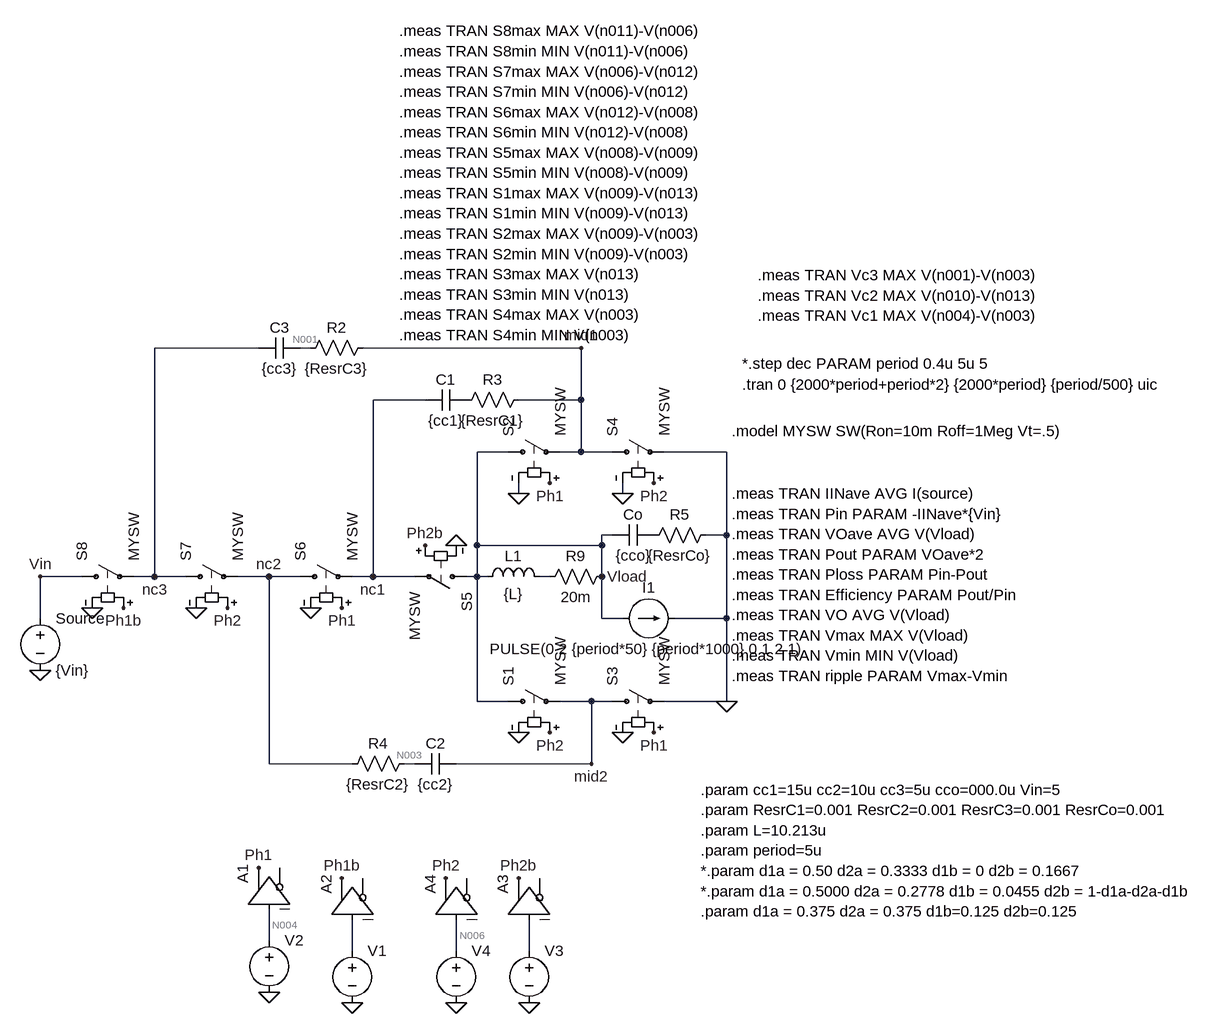
[diagram p0: schematic 4to1_dickson_split_phase_diff_cap.asc]
4to1_dickson_split_phase_diff_cap.asc, the LTspice schematic file:
Version 4
SHEET 1 1904 1156
WIRE -48 -272 -208 -272
WIRE 32 -272 16 -272
WIRE 448 -272 112 -272
WIRE 208 -192 128 -192
WIRE 448 -192 448 -272
WIRE 448 -192 352 -192
WIRE 336 -112 288 -112
WIRE 448 -112 448 -192
WIRE 448 -112 416 -112
WIRE 496 -112 448 -112
WIRE 672 -112 576 -112
WIRE 352 -48 352 -64
WIRE 512 -48 512 -64
WIRE 496 16 480 16
WIRE 672 16 672 -112
WIRE 672 16 640 16
WIRE 288 32 288 -112
WIRE 480 32 480 16
WIRE 480 32 288 32
WIRE -320 80 -384 80
WIRE -208 80 -208 -272
WIRE -208 80 -240 80
WIRE -160 80 -208 80
WIRE -32 80 -80 80
WIRE 16 80 -32 80
WIRE 128 80 128 -192
WIRE 128 80 96 80
WIRE 192 80 128 80
WIRE 288 80 288 32
WIRE 288 80 272 80
WIRE 304 80 288 80
WIRE 400 80 384 80
WIRE 480 80 480 32
WIRE -384 144 -384 80
WIRE 480 144 480 80
WIRE 512 144 480 144
WIRE 672 144 672 16
WIRE 672 144 592 144
WIRE 288 272 288 80
WIRE 336 272 288 272
WIRE 464 272 416 272
WIRE 496 272 464 272
WIRE 672 272 672 144
WIRE 672 272 576 272
WIRE -32 368 -32 80
WIRE 96 368 -32 368
WIRE 192 368 176 368
WIRE 464 368 464 272
WIRE 464 368 256 368
WIRE -32 640 -32 592
WIRE 96 656 96 608
WIRE 256 656 256 608
WIRE 368 656 368 608
FLAG -32 720 0
FLAG -48 528 Ph1
FLAG -384 224 0
FLAG -256 128 Ph1b
FLAG 80 128 Ph1
FLAG 400 -64 Ph1
FLAG 560 320 Ph1
FLAG -96 128 Ph2
FLAG 208 32 Ph2b
FLAG 560 -64 Ph2
FLAG 400 320 Ph2
FLAG -304 128 0
FLAG -144 128 0
FLAG 32 128 0
FLAG 256 32 0
FLAG 352 -48 0
FLAG 352 320 0
FLAG 512 -48 0
FLAG 512 320 0
FLAG -384 80 Vin
FLAG 480 80 Vload
FLAG 672 272 0
FLAG 240 544 Ph2
FLAG 96 736 0
FLAG 80 544 Ph1b
FLAG 368 736 0
FLAG 352 544 Ph2b
FLAG 256 736 0
FLAG 448 -272 mid1
FLAG 464 368 mid2
FLAG -208 80 nc3
FLAG -32 80 nc2
FLAG 128 80 nc1
SYMBOL voltage -32 624 R0
WINDOW 123 0 0 Left 2
WINDOW 39 0 0 Left 2
WINDOW 3 24 96 Invisible 2
SYMATTR Value PULSE(0 1 0 1p 1p {period*(d1a+d1b)-1p} {period})
SYMATTR InstName V2
SYMBOL Digital\\buf -96 592 R270
SYMATTR InstName A1
SYMBOL voltage -384 128 R0
WINDOW 123 0 0 Left 2
WINDOW 39 0 0 Left 2
SYMATTR InstName Source
SYMATTR Value {Vin}
SYMBOL sw -336 80 R270
SYMATTR InstName S8
SYMATTR Value MYSW
SYMBOL sw -176 80 R270
SYMATTR InstName S7
SYMATTR Value MYSW
SYMBOL sw 0 80 R270
SYMATTR InstName S6
SYMATTR Value MYSW
SYMBOL sw 288 80 R90
SYMATTR InstName S5
SYMATTR Value MYSW
SYMBOL sw 320 -112 R270
SYMATTR InstName S2
SYMATTR Value MYSW
SYMBOL sw 480 -112 R270
SYMATTR InstName S4
SYMATTR Value MYSW
SYMBOL sw 480 272 R270
SYMATTR InstName S3
SYMATTR Value MYSW
SYMBOL sw 320 272 R270
SYMATTR InstName S1
SYMATTR Value MYSW
SYMBOL cap -48 -256 R270
WINDOW 0 32 32 VTop 2
WINDOW 3 0 32 VBottom 2
SYMATTR InstName C3
SYMATTR Value {cc3}
SYMATTR SpiceLine ic={Vin/4*3}
SYMBOL cap 208 -176 R270
WINDOW 0 32 32 VTop 2
WINDOW 3 0 32 VBottom 2
SYMATTR InstName C1
SYMATTR Value {cc1}
SYMATTR SpiceLine ic={Vin/4*1}
SYMBOL cap 192 384 R270
WINDOW 0 32 32 VTop 2
WINDOW 3 0 32 VBottom 2
SYMATTR InstName C2
SYMATTR Value {cc2}
SYMATTR SpiceLine ic={Vin/4*2}
SYMBOL cap 496 32 R270
WINDOW 0 32 32 VTop 2
WINDOW 3 0 32 VBottom 2
SYMATTR InstName Co
SYMATTR Value {cco}
SYMBOL res 16 -256 R270
WINDOW 0 32 56 VTop 2
WINDOW 3 0 56 VBottom 2
SYMATTR InstName R2
SYMATTR Value {ResrC3}
SYMBOL res 256 -176 R270
WINDOW 0 32 56 VTop 2
WINDOW 3 0 56 VBottom 2
SYMATTR InstName R3
SYMATTR Value {ResrC1}
SYMBOL res 80 384 R270
WINDOW 0 32 56 VTop 2
WINDOW 3 0 56 VBottom 2
SYMATTR InstName R4
SYMATTR Value {ResrC2}
SYMBOL res 544 32 R270
WINDOW 0 32 56 VTop 2
WINDOW 3 0 56 VBottom 2
SYMATTR InstName R5
SYMATTR Value {ResrCo}
SYMBOL current 512 144 R270
WINDOW 0 32 40 VTop 2
WINDOW 3 -32 40 VBottom 2
WINDOW 123 0 0 Left 2
WINDOW 39 0 0 Left 2
SYMATTR InstName I1
SYMATTR Value PULSE(0 2 {period*50} {period*1000} 0 1 2 1)
SYMBOL ind 288 96 R270
WINDOW 0 32 56 VTop 2
WINDOW 3 5 56 VBottom 2
SYMATTR InstName L1
SYMATTR Value {L}
SYMATTR SpiceLine Rser=0
SYMBOL res 496 64 R90
WINDOW 0 0 56 VBottom 2
WINDOW 3 32 56 VTop 2
SYMATTR InstName R9
SYMATTR Value 20m
SYMBOL voltage 96 640 R0
WINDOW 123 0 0 Left 2
WINDOW 39 0 0 Left 2
WINDOW 3 24 96 Invisible 2
SYMATTR Value PULSE(0 1 0 1p 1p {period*d1a-1p} {period})
SYMATTR InstName V1
SYMBOL Digital\\buf 32 608 R270
SYMATTR InstName A2
SYMBOL voltage 368 640 R0
WINDOW 123 0 0 Left 2
WINDOW 39 0 0 Left 2
WINDOW 3 24 96 Invisible 2
SYMATTR Value PULSE(0 1 {period*(d1a+d1b)} 1p 1p {period*d2a-1p} {period})
SYMATTR InstName V3
SYMBOL Digital\\buf 304 608 R270
SYMATTR InstName A3
SYMBOL voltage 256 640 R0
WINDOW 123 0 0 Left 2
WINDOW 39 0 0 Left 2
WINDOW 3 24 96 Invisible 2
SYMATTR Value PULSE(0 1 {period*(d1a+d1b)} 1p 1p {period*(d2a+d2b)-1p} {period})
SYMATTR InstName V4
SYMBOL Digital\\buf 192 608 R270
SYMATTR InstName A4
TEXT 696 -216 Left 2 !.tran 0 {2000*period+period*2} {2000*period} {period/500} uic
TEXT 680 -144 Left 2 !.model MYSW SW(Ron=10m Roff=1Meg Vt=.5)
TEXT 680 -48 Left 2 !.meas TRAN IINave AVG I(source)\n.meas TRAN Pin PARAM -IINave*{Vin}\n.meas TRAN VOave AVG V(Vload)\n.meas TRAN Pout PARAM VOave*2\n.meas TRAN Ploss PARAM Pin-Pout\n.meas TRAN Efficiency PARAM Pout/Pin\n.meas TRAN VO AVG V(Vload)\n.meas TRAN Vmax MAX V(Vload)\n.meas TRAN Vmin MIN V(Vload)\n.meas TRAN ripple PARAM Vmax-Vmin
TEXT 632 408 Left 2 !.param cc1=15u cc2=10u cc3=5u cco=000.0u Vin=5\n.param ResrC1=0.001 ResrC2=0.001 ResrC3=0.001 ResrCo=0.001\n.param L=10.213u\n.param period=5u\n*.param d1a = 0.50 d2a = 0.3333 d1b = 0 d2b = 0.1667\n*.param d1a = 0.5000 d2a = 0.2778 d1b = 0.0455 d2b = 1-d1a-d2a-d1b\n.param d1a = 0.375 d2a = 0.375 d1b=0.125 d2b=0.125
TEXT 696 -248 Left 2 !*.step dec PARAM period 0.4u 5u 5
TEXT 720 -384 Left 2 !.meas TRAN Vc3 MAX V(n001)-V(n003)\n.meas TRAN Vc2 MAX V(n010)-V(n013)\n.meas TRAN Vc1 MAX V(n004)-V(n003)
TEXT 168 -760 Left 2 !.meas TRAN S8max MAX V(n011)-V(n006)\n.meas TRAN S8min MIN V(n011)-V(n006)\n.meas TRAN S7max MAX V(n006)-V(n012)\n.meas TRAN S7min MIN V(n006)-V(n012)\n.meas TRAN S6max MAX V(n012)-V(n008)\n.meas TRAN S6min MIN V(n012)-V(n008)\n.meas TRAN S5max MAX V(n008)-V(n009)\n.meas TRAN S5min MIN V(n008)-V(n009)\n.meas TRAN S1max MAX V(n009)-V(n013)\n.meas TRAN S1min MIN V(n009)-V(n013)\n.meas TRAN S2max MAX V(n009)-V(n003)\n.meas TRAN S2min MIN V(n009)-V(n003)\n.meas TRAN S3max MAX V(n013)\n.meas TRAN S3min MIN V(n013)\n.meas TRAN S4max MAX V(n003)\n.meas TRAN S4min MIN V(n003)

The netlist it stands for:
* 4to1_dickson_split_phase_diff_cap.asc
V2 N004 0 PULSE(0 1 0 1p 1p {period*(d1a+d1b)-1p} {period})
A1 N004 0 0 0 0 0 Ph1 0 BUF
V§Source Vin 0 {Vin}
S8 Vin nc3 Ph1b 0 MYSW
S7 nc3 nc2 Ph2 0 MYSW
S6 nc2 nc1 Ph1 0 MYSW
S5 Vload nc1 Ph2b 0 MYSW
S2 Vload mid1 Ph1 0 MYSW
S4 mid1 0 Ph2 0 MYSW
S3 mid2 0 Ph1 0 MYSW
S1 Vload mid2 Ph2 0 MYSW
C3 nc3 N001 {cc3} ic={Vin/4*3}
C1 nc1 P001 {cc1} ic={Vin/4*1}
C2 N003 mid2 {cc2} ic={Vin/4*2}
Co Vload P002 {cco}
R2 N001 mid1 {ResrC3}
R3 P001 mid1 {ResrC1}
R4 nc2 N003 {ResrC2}
R5 P002 0 {ResrCo}
I1 Vload 0 PULSE(0 2 {period*50} {period*1000} 0 1 2 1)
L1 Vload N002 {L} Rser=0
R9 Vload N002 20m
V1 N005 0 PULSE(0 1 0 1p 1p {period*d1a-1p} {period})
A2 N005 0 0 0 0 0 Ph1b 0 BUF
V3 N007 0 PULSE(0 1 {period*(d1a+d1b)} 1p 1p {period*d2a-1p} {period})
A3 N007 0 0 0 0 0 Ph2b 0 BUF
V4 N006 0 PULSE(0 1 {period*(d1a+d1b)} 1p 1p {period*(d2a+d2b)-1p} {period})
A4 N006 0 0 0 0 0 Ph2 0 BUF
.tran 0 {2000*period+period*2} {2000*period} {period/500} uic
.model MYSW SW(Ron=10m Roff=1Meg Vt=.5)
.meas TRAN IINave AVG I(source)
.meas TRAN Pin PARAM -IINave*{Vin}
.meas TRAN VOave AVG V(Vload)
.meas TRAN Pout PARAM VOave*2
.meas TRAN Ploss PARAM Pin-Pout
.meas TRAN Efficiency PARAM Pout/Pin
.meas TRAN VO AVG V(Vload)
.meas TRAN Vmax MAX V(Vload)
.meas TRAN Vmin MIN V(Vload)
.meas TRAN ripple PARAM Vmax-Vmin
.param cc1=15u cc2=10u cc3=5u cco=000.0u Vin=5
.param ResrC1=0.001 ResrC2=0.001 ResrC3=0.001 ResrCo=0.001
.param L=10.213u
.param period=5u
*.param d1a = 0.50 d2a = 0.3333 d1b = 0 d2b = 0.1667
*.param d1a = 0.5000 d2a = 0.2778 d1b = 0.0455 d2b = 1-d1a-d2a-d1b
.param d1a = 0.375 d2a = 0.375 d1b=0.125 d2b=0.125
*.step dec PARAM period 0.4u 5u 5
.meas TRAN Vc3 MAX V(n001)-V(n003)
.meas TRAN Vc2 MAX V(n010)-V(n013)
.meas TRAN Vc1 MAX V(n004)-V(n003)
.meas TRAN S8max MAX V(n011)-V(n006)
.meas TRAN S8min MIN V(n011)-V(n006)
.meas TRAN S7max MAX V(n006)-V(n012)
.meas TRAN S7min MIN V(n006)-V(n012)
.meas TRAN S6max MAX V(n012)-V(n008)
.meas TRAN S6min MIN V(n012)-V(n008)
.meas TRAN S5max MAX V(n008)-V(n009)
.meas TRAN S5min MIN V(n008)-V(n009)
.meas TRAN S1max MAX V(n009)-V(n013)
.meas TRAN S1min MIN V(n009)-V(n013)
.meas TRAN S2max MAX V(n009)-V(n003)
.meas TRAN S2min MIN V(n009)-V(n003)
.meas TRAN S3max MAX V(n013)
.meas TRAN S3min MIN V(n013)
.meas TRAN S4max MAX V(n003)
.meas TRAN S4min MIN V(n003)
.backanno
.end